# EasyEDA Pro project SCH.epro

# Schematic EDA-TEST2
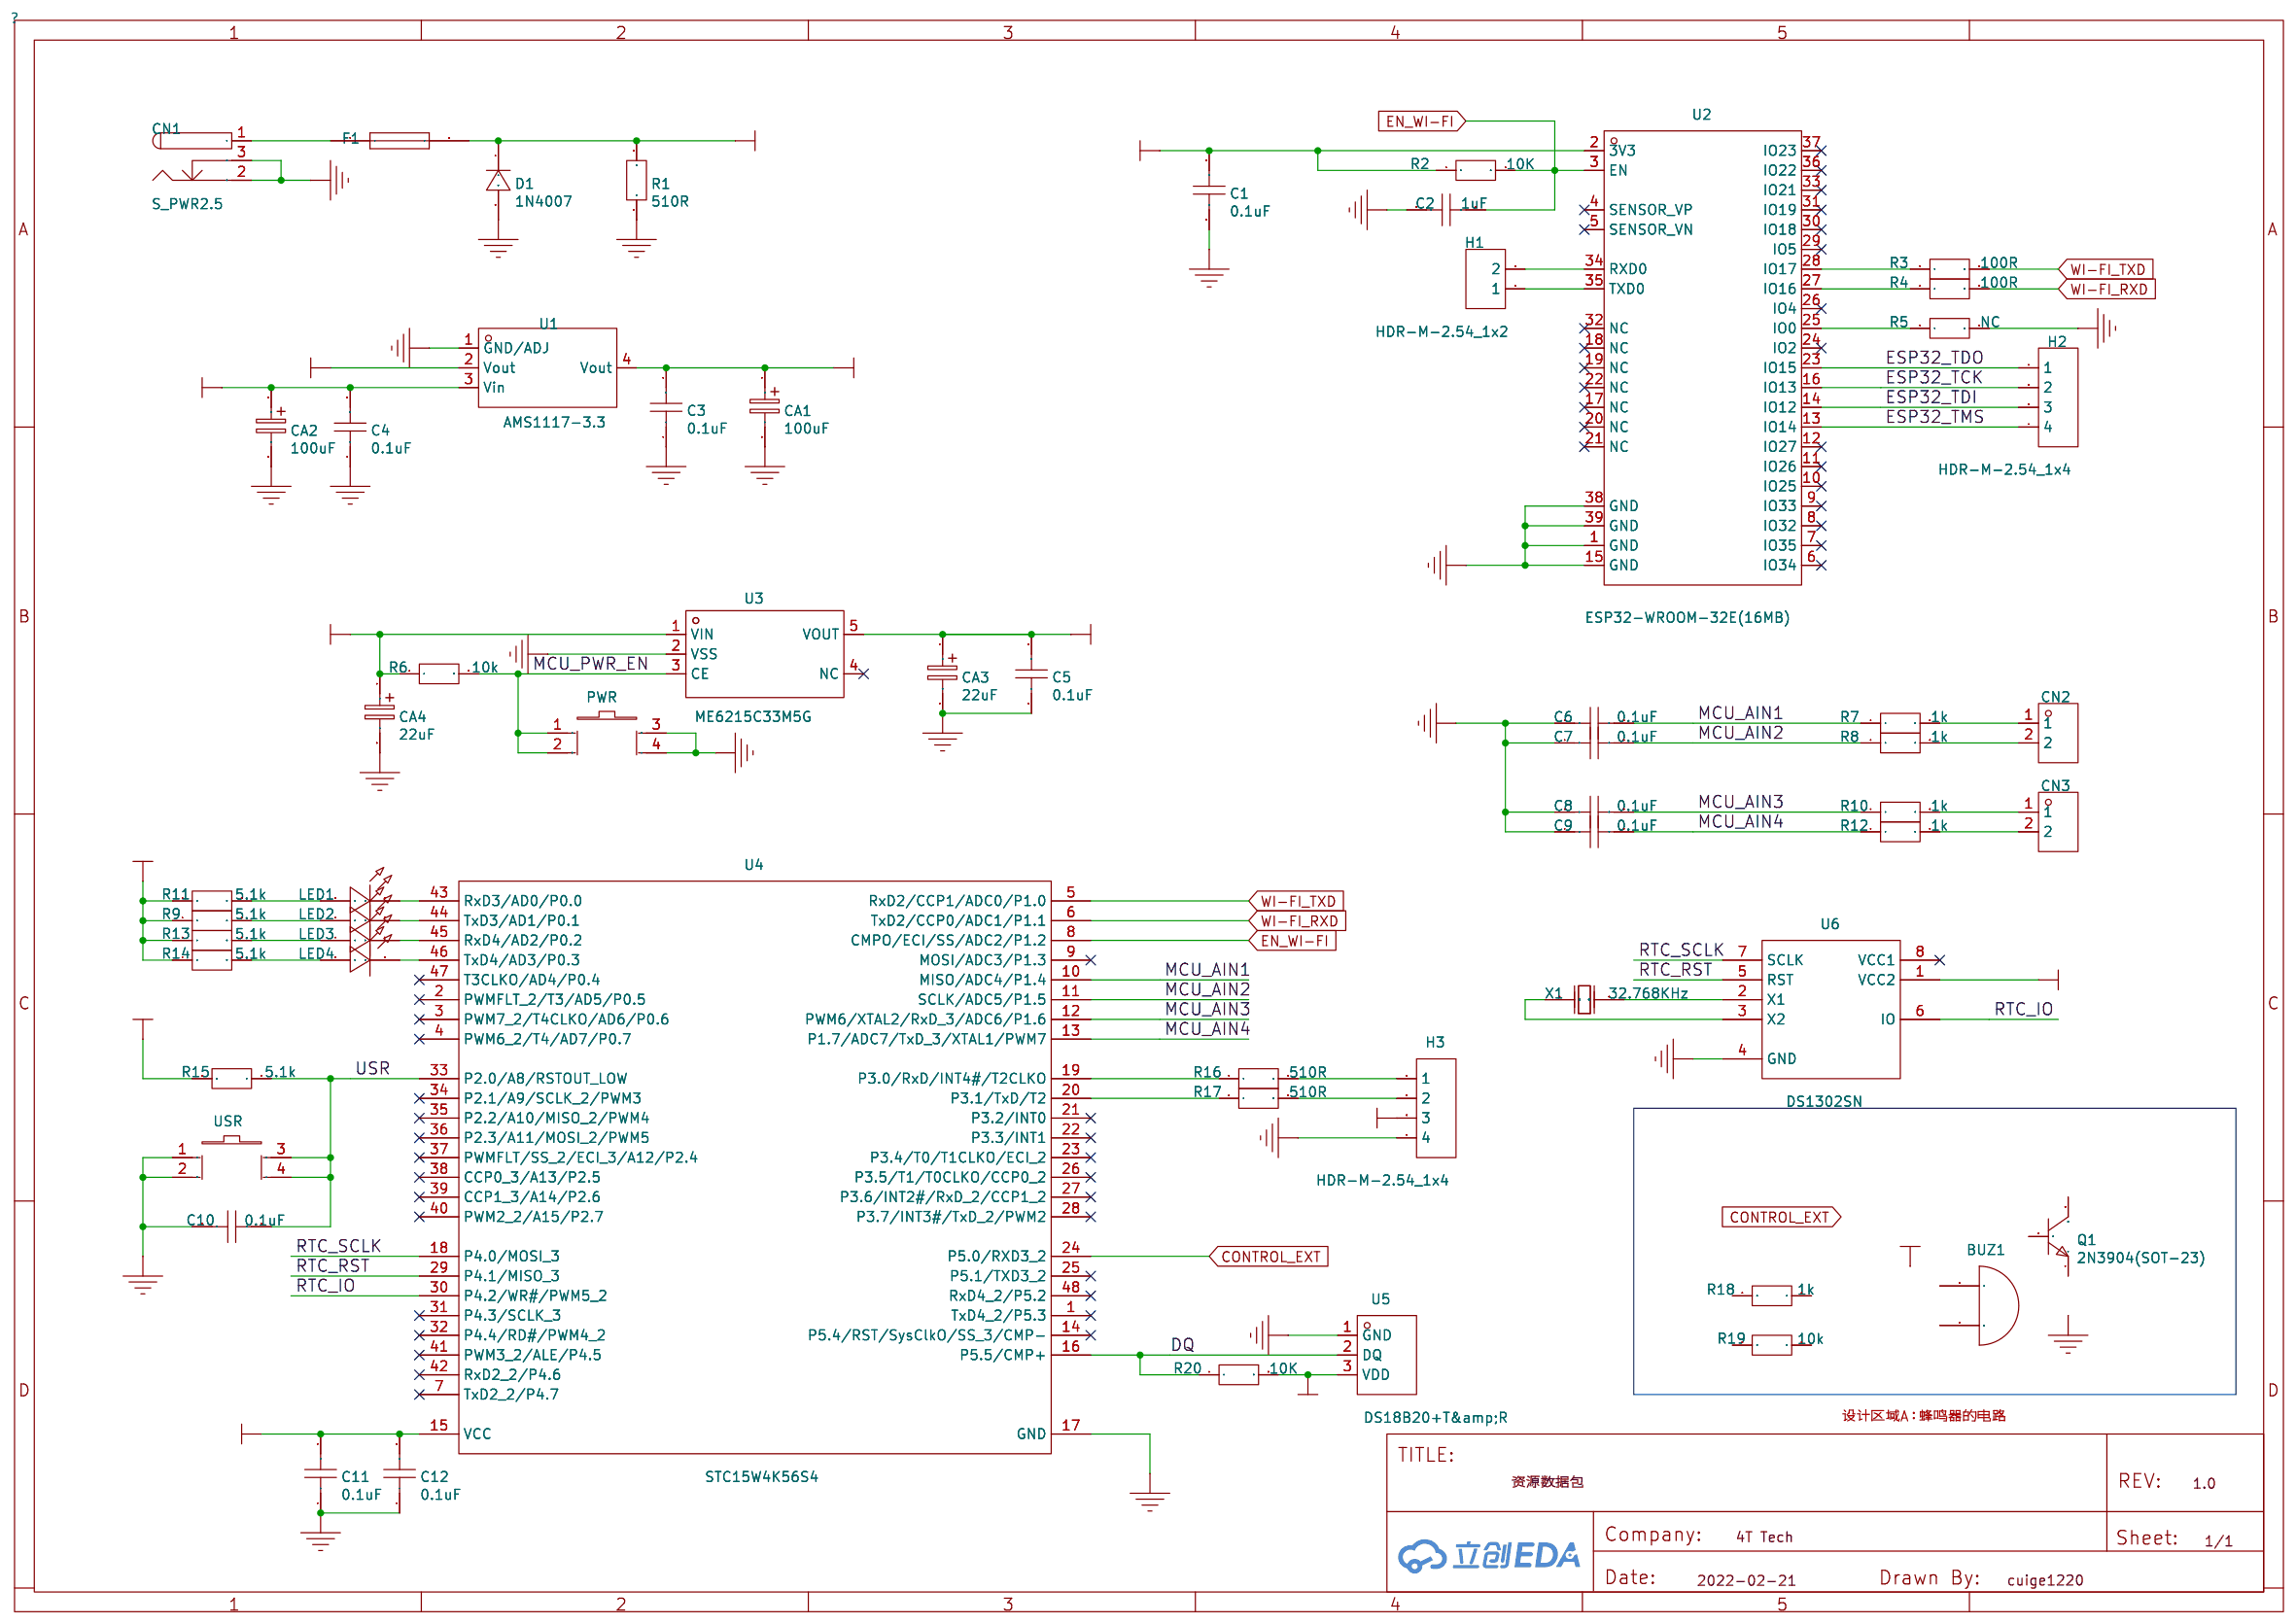
[diagram p0: schematic sheet]

## Parts
BUZ1  BUZ1
C1  0.1uF
C2  1uF
C3  0.1uF
C4  0.1uF
C5  0.1uF
C6  0.1uF
C7  0.1uF
C8  0.1uF
C9  0.1uF
C10  0.1uF
C11  0.1uF
C12  0.1uF
CA1  100uF
CA2  100uF
CA3  22uF
CA4  22uF
CN1  S_PWR2.5
CN2  DB128L-5.08-2P
CN3  DB128L-5.08-2P
D1  1N4007
F1  ASMD1210-075
H1  HDR-M-2.54_1x2
H2  HDR-M-2.54_1x4
H3  HDR-M-2.54_1x4
LED1  LED-TH-3mm_R
LED2  LED-TH-3mm_R
LED3  LED-TH-3mm_R
LED4  LED-TH-3mm_R
PWR  6x6x6Plastic head
Q1  2N3904(SOT-23)
R1  510R
R2  10K
R3  100R
R4  100R
R5  NC
R6  10k
R7  1k
R8  1k
R9  5.1k
R10  1k
R11  5.1k
R12  1k
R13  5.1k
R14  5.1k
R15  5.1k
R16  510R
R17  510R
R18  1k
R19  10k
R20  10K
U1  AMS1117-3.3
U2  ESP32-WROOM-32E(16MB)
U3  ME6215C33M5G
U4  STC15W4K56S4
U5  DS18B20+T&amp;R
U6  DS1302SN
USR  6x6x6Plastic head
X1  32.768KHz

## Library data of the parts
BUZ1 = BUZ1
C1 C3-C12 = 0.1uF
C2 = 1uF
CA1 CA2 = 100uF
CA3 CA4 = 22uF
CN1 = S_PWR2.5
CN2 CN3 = DB128L-5.08-2P: Supplier: LCSC; Supplier Part: C395868; Manufacturer: DIBO
D1 = 1N4007: Supplier: LCSC; Manufacturer: SEMTECH; Supplier Part: C106903
F1 = ASMD1210-075: Published: 8-Jun-2000; LatestRevisionDate: 17-Jul-2002; LatestRevisionNote: Re-released for DXP Platform.; PackageReference: PIN-W2/E2.8; Publisher: Altium Limited; PackageDescription: Thru-Hole; 2 Leads
H1 = HDR-M-2.54_1x2: Supplier Part: C124375; Supplier: LCSC
H2 H3 = HDR-M-2.54_1x4: Supplier Part: C124378; Supplier: LCSC
LED1-LED4 = 204-10SDRD/S530-A3-L: Manufacturer: EVERLIGHT(台湾亿光); Supplier Part: C84774; Supplier: LCSC
PWR USR = 6x6x6Plastic head: Supplier Part: C23550; Supplier: LCSC; Manufacturer: ReliaPro; image: http://image.lceda.cn/szlcsc/C23550.jpg
Q1 = 2n3904S-RTK/PS: Supplier: LCSC; Manufacturer: KEC; Supplier Part: C18536; Paste Type: SOT-23
R1 R16 R17 = 510R
R2 R6 R19 R20 = 10k
R3 R4 = 100R
R5 = NC
R7 R8 R10 R12 R18 = 1k
R9 R11 R13-R15 = 5.1k
U1 = AMS1117-3.3: Supplier: LCSC; Manufacturer: AMS; image: //image.lceda.cn/szlcsc/C6186.jpg; Supplier Part: C6186; JLCPCB Part Class: Basic; JLCPCB SMD: Yes
U2 = ESP32-WROOM-32E(16MB): Supplier: LCSC; Supplier Part: C701343; Manufacturer: Espressif Systems; JLCPCB Part Class: Extended Part
U3 = ME6215C33M5G: Supplier: LCSC; Manufacturer: MICRONE; Supplier Part: C84119; JLCPCB Part Class: Extend
U4 = STC15W4K56S4: Supplier: LCSC; Manufacturer: STC; image: //image.lceda.cn/szlcsc/C81639.jpg; Supplier Part: C81639; JLCPCB Part Class: Extend
U5 = DS18B20+T&R: Supplier: LCSC; Supplier Part: C880672; Manufacturer: MAXIM(美信); JLCPCB Part Class: Extended Part
U6 = DS1302SN: Trickle Charge Timekeeping Chip
X1 = CFS-20632768EZFB: Supplier: LCSC; Supplier Part: C326534; Manufacturer: CITIZEN

## Nets
3.3V_MCU: C5.2 C11.2 C12.2 CA3.1 H3.3 R9.1 R11.1 R13.1 R14.1 R15.2 R20.2 U3.5(VOUT) U4.15(VCC) U5.3(VDD) U6.1(VCC2)
3.3V_WIFI: C1.2 C3.2 CA1.1 R2.1 U1.2(Vout) U1.4(Vout) U2.2(3V3)
+5V0: C4.2 CA2.1 CA4.1 D1.1 F1.2 R1.2 R6.1 U1.3(Vin) U3.1(VIN)
GND: C1.1 C2.2 C3.1 C4.1 C5.1 C6.1 C7.1 C8.1 C9.1 C10.2 C11.1 C12.1 CA1.2 CA2.2 CA3.2 CA4.2 CN1.2 CN1.3 D1.2 H3.4 PWR.3 PWR.4 R1.1 R5.2 U1.1(GND/ADJ) U2.1(GND) U2.15(GND) U2.38(GND) U2.39(GND) U3.2(VSS) U4.17(GND) U5.1(GND) U6.4(GND) USR.1 USR.2
CONTROL_EXT: U4.24(P5.0/RXD3_2)
DQ: R20.1 U4.16(P5.5/CMP+) U5.2(DQ)
EN_WI-FI: C2.1 R2.2 U2.3(EN) U4.8(CMPO/ECI/SS/ADC2/P1.2)
ESP32_TCK: H2.2 U2.16(IO13)
ESP32_TDI: H2.3 U2.14(IO12)
ESP32_TDO: H2.1 U2.23(IO15)
ESP32_TMS: H2.4 U2.13(IO14)
MCU_AIN1: C6.2 R7.1 U4.10(MISO/ADC4/P1.4)
MCU_AIN2: C7.2 R8.1 U4.11(SCLK/ADC5/P1.5)
MCU_AIN3: C8.2 R10.1 U4.12(PWM6/XTAL2/RxD_3/ADC6/P1.6)
MCU_AIN4: C9.2 R12.1 U4.13(P1.7/ADC7/TxD_3/XTAL1/PWM7)
MCU_PWR_EN: PWR.1 PWR.2 R6.2 U3.3(CE)
RTC_IO: U4.30(P4.2/WR#/PWM5_2) U6.6(IO)
RTC_RST: U4.29(P4.1/MISO_3) U6.5(RST)
RTC_SCLK: U4.18(P4.0/MOSI_3) U6.7(SCLK)
USR: C10.1 R15.1 U4.33(P2.0/A8/RSTOUT_LOW) USR.3 USR.4
WI-FI_RXD: R4.2 U4.6(TxD2/CCP0/ADC1/P1.1)
WI-FI_TXD: R3.2 U4.5(RxD2/CCP1/ADC0/P1.0)
Net-(CN1-1): CN1.1 F1.1
Net-(CN2-1): CN2.1 R7.2
Net-(CN2-2): CN2.2 R8.2
Net-(CN3-1): CN3.1 R10.2
Net-(CN3-2): CN3.2 R12.2
Net-(H1-1): H1.1 U2.35(TXD0)
Net-(H1-2): H1.2 U2.34(RXD0)
Net-(H3-1): H3.1 R16.2
Net-(H3-2): H3.2 R17.2
Net-(LED1-1): LED1.1 R9.2
Net-(LED1-2): LED1.2 U4.43(RxD3/AD0/P0.0)
Net-(LED2-1): LED2.1 R11.2
Net-(LED2-2): LED2.2 U4.44(TxD3/AD1/P0.1)
Net-(LED3-1): LED3.1 R13.2
Net-(LED3-2): LED3.2 U4.45(RxD4/AD2/P0.2)
Net-(LED4-1): LED4.1 R14.2
Net-(LED4-2): LED4.2 U4.46(TxD4/AD3/P0.3)
Net-(R3-1): R3.1 U2.28(IO17)
Net-(R4-1): R4.1 U2.27(IO16)
Net-(R5-1): R5.1 U2.25(IO0)
Net-(R16-1): R16.1 U4.19(P3.0/RxD/INT4#/T2CLKO)
Net-(R17-1): R17.1 U4.20(P3.1/TxD/T2)
Net-(U6-2): U6.2(X1) X1.2(OSC2)
Net-(U6-3): U6.3(X2) X1.1(OSC1)

Not connected (* = marked no-connect by the designer): BUZ1 1(A) 2(B); Q1 1(E) 2(B) 3(C); R18 1 2; R19 1 2; U2 4(SENSOR_VP)* 5(SENSOR_VN)* 6(IO34)* 7(IO35)* 8(IO32)* 9(IO33)* 10(IO25)* 11(IO26)* 12(IO27)* 17(NC)* 18(NC)* 19(NC)* 20(NC)* 21(NC)* 22(NC)* 24(IO2)* 26(IO4)* 29(IO5)* 30(IO18)* 31(IO19)* 32(NC)* 33(IO21)* 36(IO22)* 37(IO23)*; U3 4(NC)*; U4 1(TxD4_2/P5.3)* 2(PWMFLT_2/T3/AD5/P0.5)* 3(PWM7_2/T4CLKO/AD6/P0.6)* 4(PWM6_2/T4/AD7/P0.7)* 7(TxD2_2/P4.7)* 9(MOSI/ADC3/P1.3)* 14(P5.4/RST/SysClkO/SS_3/CMP-)* 21(P3.2/INT0)* 22(P3.3/INT1)* 23(P3.4/T0/T1CLKO/ECI_2)* 25(P5.1/TXD3_2)* 26(P3.5/T1/T0CLKO/CCP0_2)* 27(P3.6/INT2#/RxD_2/CCP1_2)* 28(P3.7/INT3#/TxD_2/PWM2)* 31(P4.3/SCLK_3)* 32(P4.4/RD#/PWM4_2)* 34(P2.1/A9/SCLK_2/PWM3)* 35(P2.2/A10/MISO_2/PWM4)* 36(P2.3/A11/MOSI_2/PWM5)* 37(PWMFLT/SS_2/ECI_3/A12/P2.4)* 38(CCP0_3/A13/P2.5)* 39(CCP1_3/A14/P2.6)* 40(PWM2_2/A15/P2.7)* 41(PWM3_2/ALE/P4.5)* 42(RxD2_2/P4.6)* 47(T3CLKO/AD4/P0.4)* 48(RxD4_2/P5.2)*; U6 8(VCC1)*

## Notes on the sheet
- 设计区域A：蜂鸣器的电路
